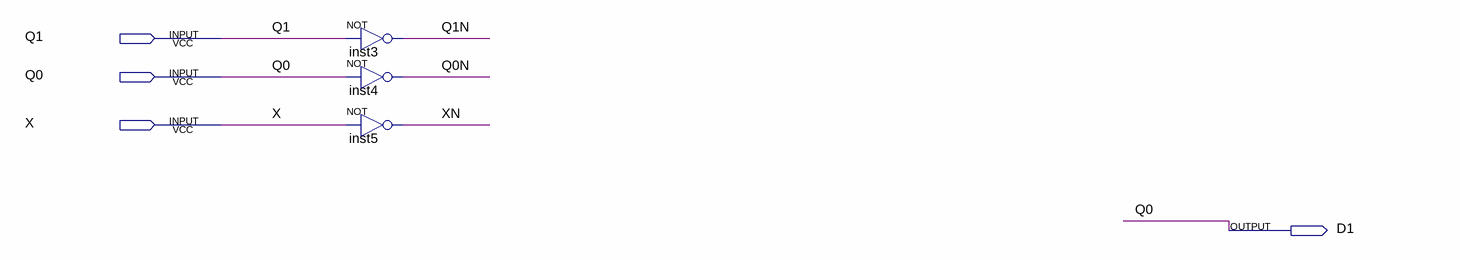
[diagram p0: schematic sheet]
// Quartus schematic D1.bdf as structural Verilog: 3 symbols, 4 pins
module D1 (
  input  Q1,
  input  Q0,
  input  X,
  output D1
);

  wire Q0N, Q1N, XN;

  not inst3 (Q1N, Q1);
  not inst4 (Q0N, Q0);
  not inst5 (XN, X);

  assign D1 = Q0;
endmodule
